# Altium schematic sheet PowerSupply.SchDoc: Power Board
size Tabloid; Date: 12/20/2022; Engineer: Terry D. Schevker; Revision: 1.0; SheetNumber: 3; SheetTotal: 4
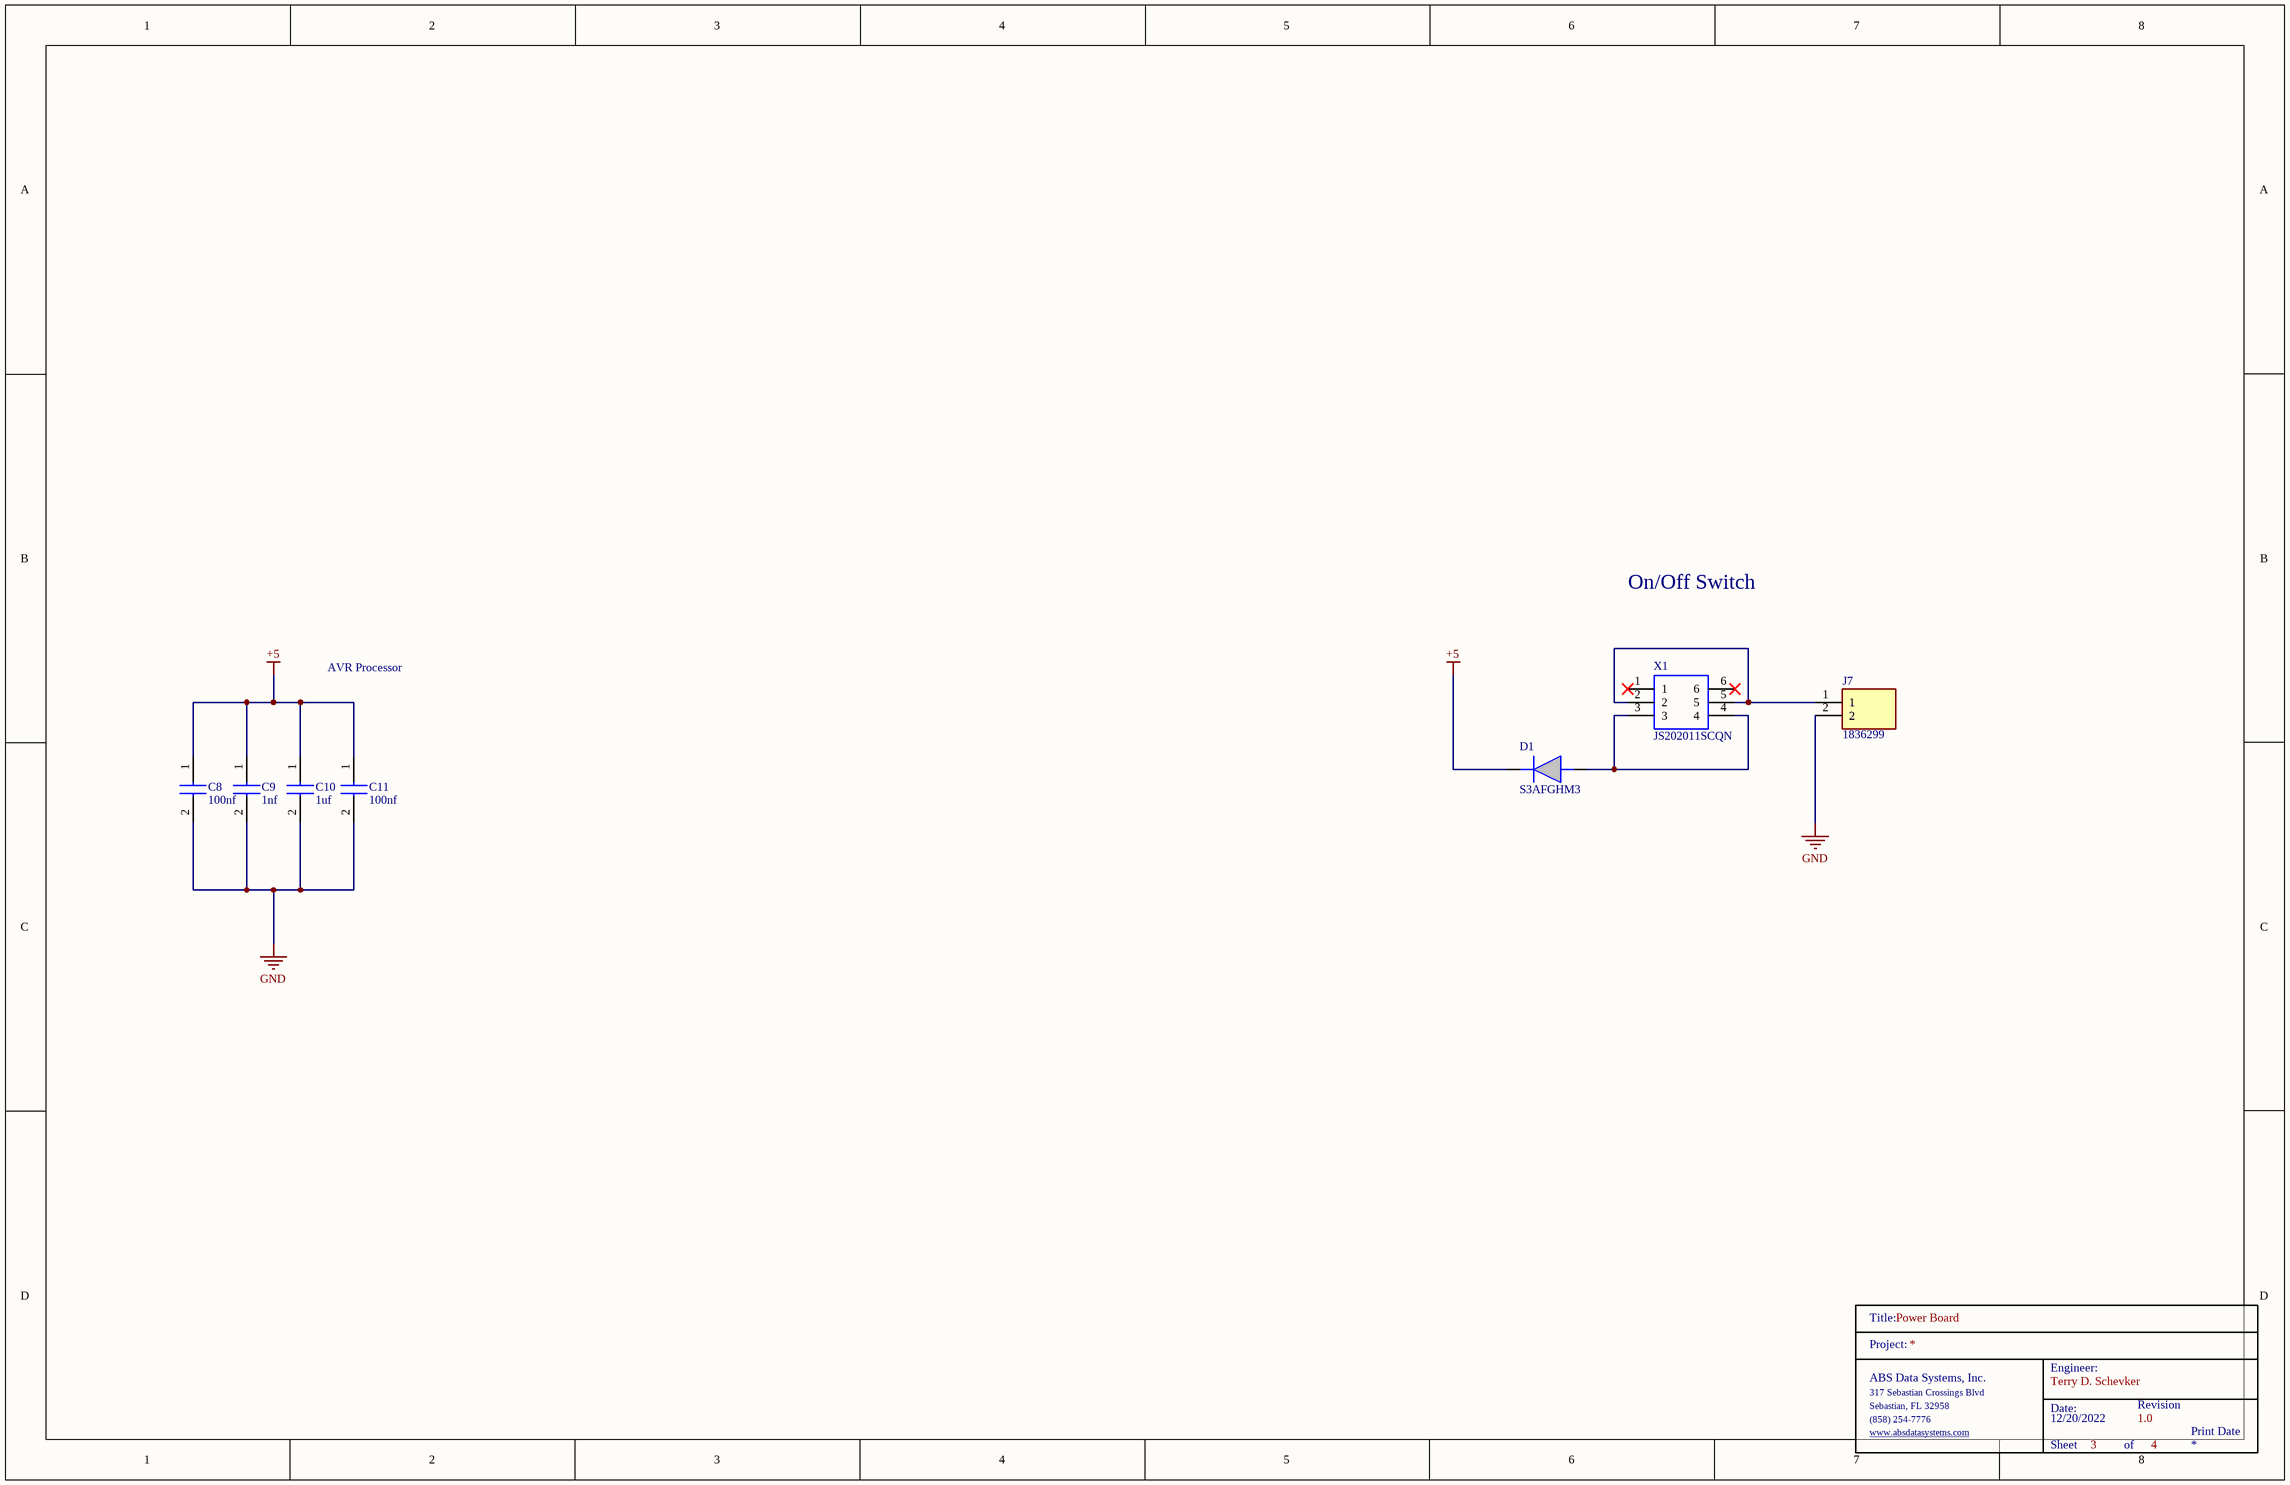
[diagram p0: PowerSupply.SchDoc]

## Parts
C8  100nf  [0603]
C9  1nf  [0603]
C10  1uf  [0603]
C11  100nf  [0603]
D1  S3AFGHM3  [DO-221AC]
J7  1836299  [1836299]
TitleBlock_4  TitleBlock  (value not drawn)  (graphical)
X1  JS202011SCQN  [JS202011SCQN]

## Nets
+5: C8.1 C9.1 C10.1 C11.1 D1.1(K)
GND: C8.2 C9.2 C10.2 C11.2 J7.2
NetD1_2: D1.2(A) X1.3 X1.4
NetJ7_1: J7.1 X1.2 X1.5

Not connected (* = marked no-connect by the designer): X1 1* 6*

## Notes on the sheet
- On/Off Switch
- AVR Processor
- Print Date
- (in symbol TitleBlock) Title:; Project:; Engineer:; ABS Data Systems, Inc.; 317 Sebastian Crossings Blvd; Sebastian, FL 32958; Date:; Revision; (858) 254-7776; www.absdatasystems.com; Sheet; of

## Library data of the parts
C8 C11 = CL10B104JB8NNNC: Samsung Electro-Mechanics 0603 100nf
C9 = CL10B102KB8NNNL: Samsung Electro-Mechanics 0603 1nf
C10 = CL10B105KA8NNNL: Samsung Electro-Mechanics 0603 1uf
D1 = S3AFGHM3/I: Rectifiers VR=400V, IO=3A; Manufacturer_Name: Comchip Technology; Manufacturer_Part_Number: 1N4001-G; Mouser Part Number: 750-1N4001-G; Mouser Price/Stock: https://www.mouser.co.uk/ProductDetail/Comchip-Technology/1N4001-G?qs=2qJf6qQ4IOKJYZQUWvVExw%3D%3D; Datasheet Link: https://datasheet.datasheetarchive.com/originals/distributors/Datasheets-7/DSA-138621.pdf
J7 = 1836299: Phoenix Contact MCV Series, 5.08mm Pitch 2 Way Base Strip, Solder Termination, 8A; Geometry.Height: 9.35mm; Mouser Part Number: 651-1836299; Mouser Price/Stock: https://www.mouser.co.uk/ProductDetail/Phoenix-Contact/1836299?qs=W3wJikR1%252BS4CgO2c38K3Tg%3D%3D; Manufacturer_Name: Phoenix Contact; Manufacturer_Part_Number: 1836299; Datasheet Link: https://www.phoenixcontact.com/en-in/products/pcb-header-mcv-15-2-g-508-1836299
X1 = JS202011SCQN: Sub miniature slide switches; Manufacturer_Name: C & K COMPONENTS; Geometry.Height: 5.5mm; Mouser Part Number: 611-JS202011SCQN; Mouser Price/Stock: https://www.mouser.co.uk/ProductDetail/CK/JS202011SCQN?qs=LgMIjt8LuD95JYWxZ7NvZA%3D%3D; Manufacturer_Part_Number: JS202011SCQN; Datasheet Link: http://www.ckswitches.com/media/1422/js.pdf